# EAGLE design SensorNode (EAGLE 7.6.0)
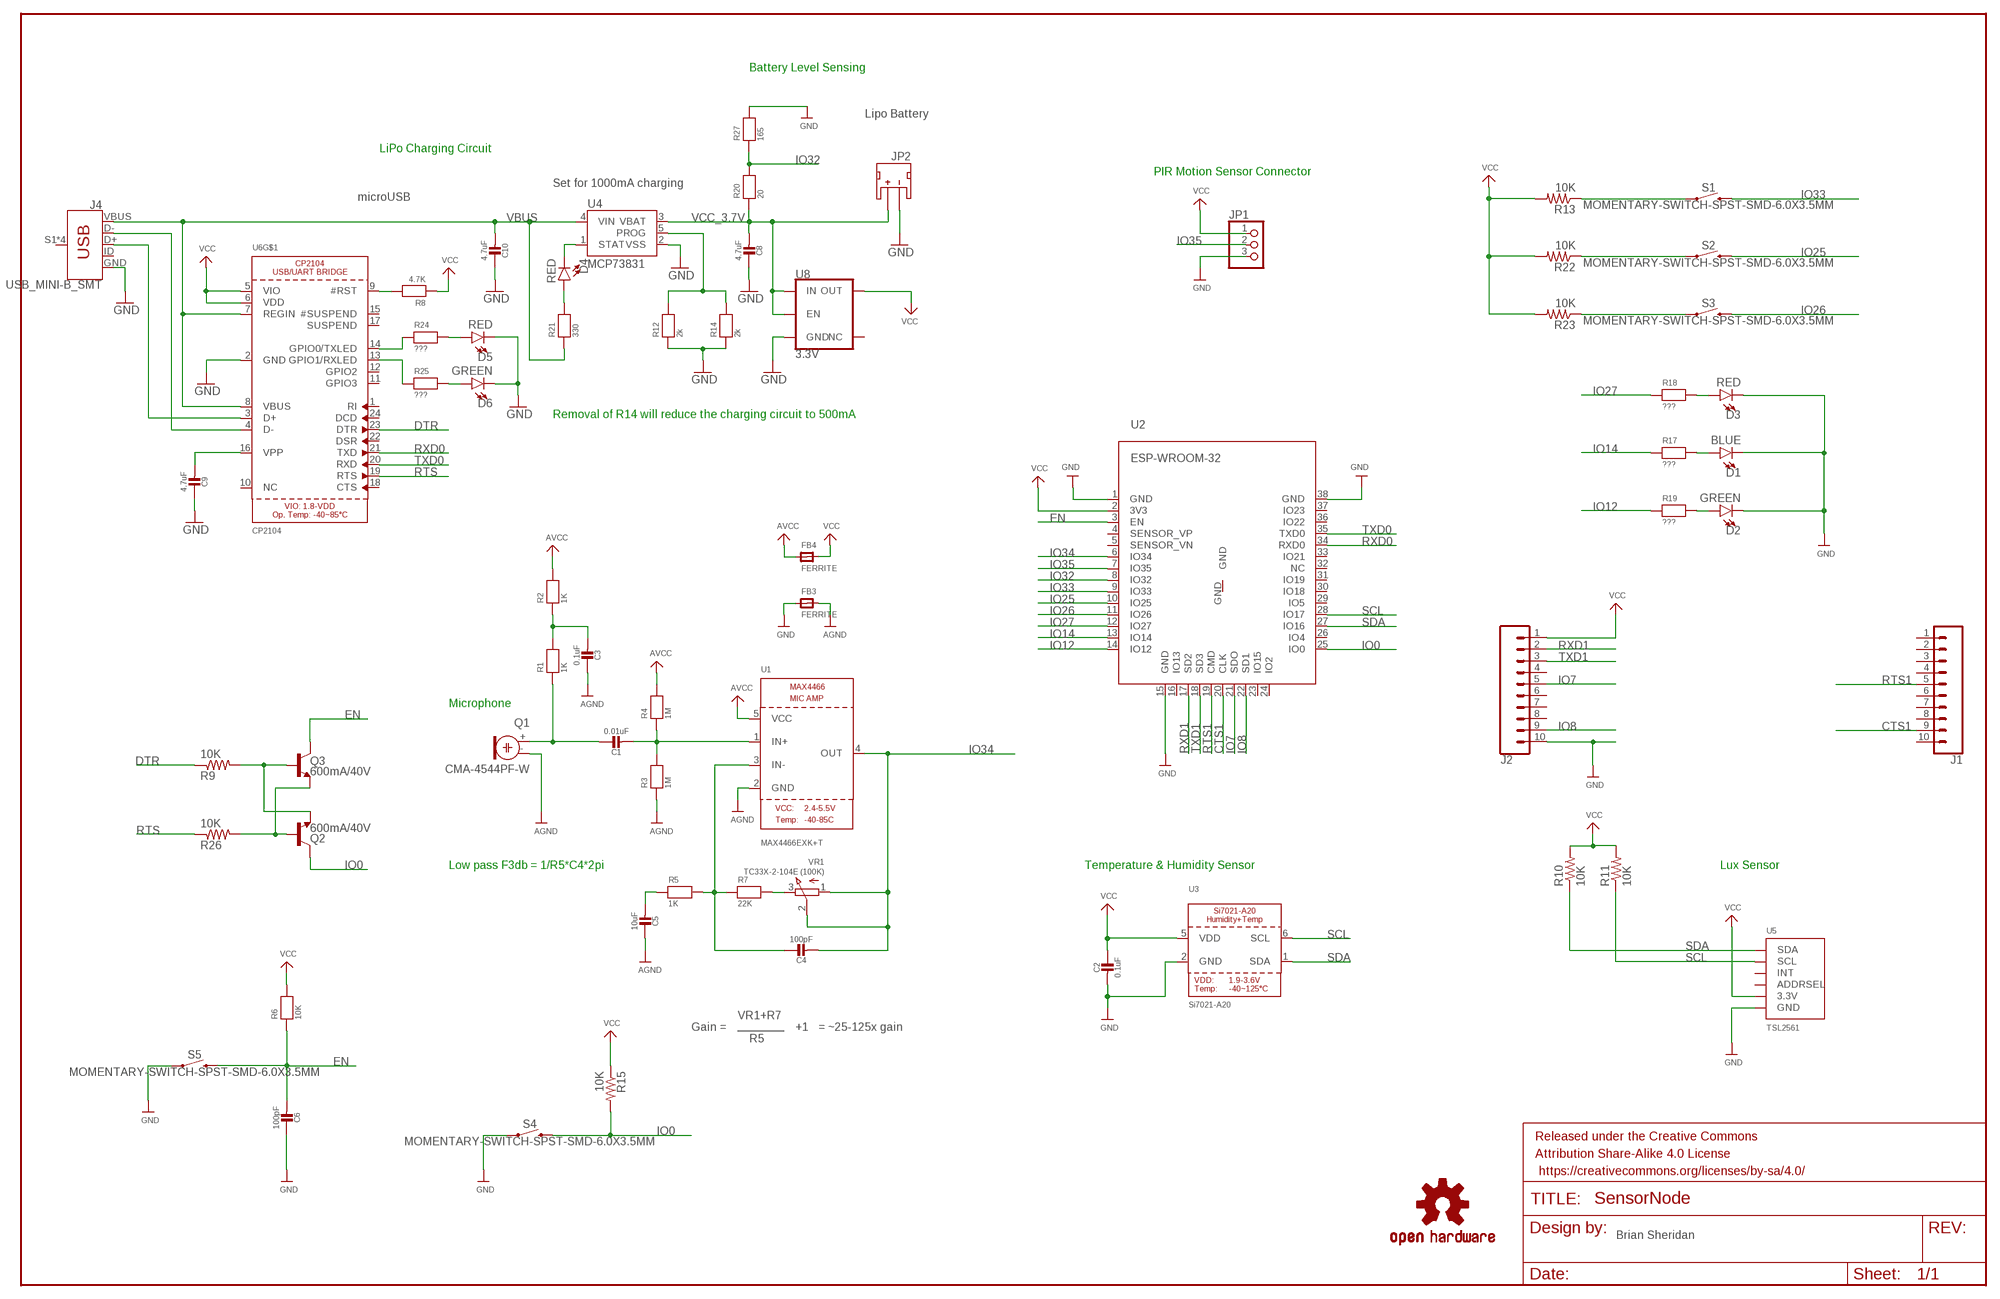
[diagram p0: schematic, sheet 1]

## Parts
C1  0.01uF  CAP_CERAMIC0805-NOOUTLINE  [0805-NO]
C2  0.1uF  CAP_CERAMIC0805-NOOUTLINE  [0805-NO]
C3  0.1uF  CAP_CERAMIC0805-NOOUTLINE  [0805-NO]
C4  100pF  CAP_CERAMIC0805-NOOUTLINE  [0805-NO]
C5  10uF  CAP_CERAMIC0805-NOOUTLINE  [0805-NO]
C6  100pF  CAP_CERAMIC0805-NOOUTLINE  [0805-NO]
C8  4.7uF  CAP_CERAMIC0805-NOOUTLINE  [0805-NO]
C9  4.7uF  CAP_CERAMIC0805-NOOUTLINE  [0805-NO]
C10  4.7uF  CAP_CERAMIC0805-NOOUTLINE  [0805-NO]
D1  BLUE  LED-BLUE1206  [LED-1206]
D2  GREEN  LED-GREEN1206  [LED-1206]
D3  RED  LED-RED1206  [LED-1206]
D4  RED  LED-RED1206  [LED-1206]
D5  RED  LED-RED1206  [LED-1206]
D6  GREEN  LED-GREEN1206  [LED-1206]
FB3  FERRITE  FERRITE0805  [0805]
FB4  FERRITE  FERRITE0805  [0805]
FRAME1  FRAME-LEDGER  [CREATIVE_COMMONS]
J1  CONN_102MMSMD  [1X10-2MM-SMD]
J2  CONN_102MMSMD  [1X10-2MM-SMD]
J4  USB_MINI-B_SMT  [USB-MINIB]
JP1  HEADER-1X376MIL  [1X03_ROUND_76]
JP2  JST  JST_2MM_MALE  [JST-2-SMD]
LOGO1  OSHW-LOGOM  [OSHW-LOGO-M]
Q1  CMA-4544PF-W  ELECTRET  [ELECTRET_9.7]
Q2  600mA/40V  TRANS_NPN-MMBT2222AL  [SOT23-3]
Q3  600mA/40V  TRANS_NPN-MMBT2222AL  [SOT23-3]
R1  1K  RESISTOR0805  [0805]
R2  1K  RESISTOR0805  [0805]
R3  1M  RESISTOR0805  [0805]
R4  1M  RESISTOR0805  [0805]
R5  1K  RESISTOR0805  [0805]
R6  10K  RESISTOR0805  [0805]
R7  22K  RESISTOR0805  [0805]
R8  4.7K  RESISTOR0805  [0805]
R9  10K  R-US_R0805  [R0805]
R10  10K  R-US_R0805  [R0805]
R11  10K  R-US_R0805  [R0805]
R12  2k  RESISTOR0805  [0805]
R13  10K  R-US_R0805  [R0805]
R14  2k  RESISTOR0805  [0805]
R15  10K  R-US_R0805  [R0805]
R17  ???  RESISTOR0805  [0805]
R18  ???  RESISTOR0805  [0805]
R19  ???  RESISTOR0805  [0805]
R20  20  RESISTOR0805  [0805]
R21  330  RESISTOR0805  [0805]
R22  10K  R-US_R0805  [R0805]
R23  10K  R-US_R0805  [R0805]
R24  ???  RESISTOR0805  [0805]
R25  ???  RESISTOR0805  [0805]
R26  10K  R-US_R0805  [R0805]
R27  165  RESISTOR0805  [0805]
S1  MOMENTARY-SWITCH-SPST-SMD-6.0X3.5MM  [TACTILE_SWITCH_SMD_6.0X3.5MM]
S2  MOMENTARY-SWITCH-SPST-SMD-6.0X3.5MM  [TACTILE_SWITCH_SMD_6.0X3.5MM]
S3  MOMENTARY-SWITCH-SPST-SMD-6.0X3.5MM  [TACTILE_SWITCH_SMD_6.0X3.5MM]
S4  MOMENTARY-SWITCH-SPST-SMD-6.0X3.5MM  [TACTILE_SWITCH_SMD_6.0X3.5MM]
S5  MOMENTARY-SWITCH-SPST-SMD-6.0X3.5MM  [TACTILE_SWITCH_SMD_6.0X3.5MM]
U1  MAX4466EXK+T  MAX4466""  [SC70-5]
U2  ESP-WROOM-32  [ESP-WROOM-32]
U3  Si7021-A20  SI7021-A20  [DFN6_3X3_SI]
U4  MCP73831  [SOT23-5]
U5  TSL2561  [TSL2561_FN]
U6  CP2104  [QFN24_4MM_SMSC]
U8  3.3V  V_REG_AP2112K-3.3V  [SOT23-5]
VR1  TC33X-2-104E (100K)  TRIMPOTTC33X-2  [TRIMPOT_BOURNS_TC33X-2]

## Nets
AGND: C3.1 C5.1 FB3.2 Q1.- R3.1 U1.2(GND)
AVCC: FB4.1 R2.2 R4.2 U1.5(VCC)
CTS1: J1.9 U2.20(CLK)
DTR: R9.1 U6.23(DTR)
EN: C6.2 Q3.3(C) R6.1 S5.2 U2.3(EN)
GND: C2.2 C6.1 C8.1 C9.1 C10.1 D1.C D2.C D3.C D5.C D6.C FB3.1 J2.10 J4.GND JP1.3 JP2.1(-) R12.1 R14.1 R27.2 S4.1 S5.1 U2.1(GND) U2.15(GND) U2.38(GND) U3.2(GND) U4.2(VSS) U5.VSS(GND) U6.2(GND) U8.2(GND)
IO0: Q2.3(C) R15.2 S4.2 U2.25(IO0)
IO7: J2.5 U2.21(SDO)
IO8: J2.9 U2.22(SD1)
IO12: R19.1 U2.14(IO12)
IO14: R17.1 U2.13(IO14)
IO25: S2.2 U2.10(IO25)
IO26: S3.2 U2.11(IO26)
IO27: R18.1 U2.12(IO27)
IO32: R20.2 R27.1 U2.8(IO32)
IO33: S1.2 U2.9(IO33)
IO34: C4.2 U1.4(OUT) U2.6(IO34) VR1.1(A) VR1.2(S)
IO35: JP1.2 U2.7(IO35)
N$3: C1.1 Q1.+ R1.1
N$5: C1.2 R3.2 R4.1 U1.1(IN+)
N$7: C4.1 R5.2 R7.1 U1.3(IN-)
N$8: C5.2 R5.1
N$9: R7.2 VR1.3(E)
N$10: C9.2 U6.16(VPP)
N$11: R8.2 U6.9(#RST)
N$13: Q2.2(E) Q3.1(B) R9.2
N$14: Q2.1(B) Q3.2(E) R26.2
N$23: D4.A R21.2
N$24: R13.1 S1.1
N$25: D3.A R18.2
N$26: D1.A R17.2
N$27: D2.A R19.2
N$28: R22.1 S2.1
N$29: R23.1 S3.1
N$32: C3.2 R1.2 R2.1
N$36: J4.D- U6.4(D-)
N$37: J4.D+ U6.3(D+)
N$41: D5.A R24.2
N$42: R24.1 U6.14(GPIO0/TXLED)
N$43: R25.1 U6.13(GPIO1/RXLED)
N$44: D6.A R25.2
PROG: R12.2 R14.2 U4.5(PROG)
RTS: R26.1 U6.19(RTS)
RTS1: J1.5 U2.19(CMD)
RXD0: U2.34(RXD0) U6.21(TXD)
RXD1: J2.2 U2.17(SD2)
SCL: R11.1 U2.28(IO17) U3.6(SCL) U5.CLK(SCL)
SDA: R10.1 U2.27(IO16) U3.1(SDA) U5.DATA(SDA)
STAT: D4.C U4.1(STAT)
TXD0: U2.35(TXD0) U6.20(RXD)
TXD1: J2.3 U2.18(SD3)
VBUS: C10.2 J4.VBUS R21.1 U4.4(VIN) U6.7(REGIN) U6.8(VBUS)
VCC: C2.1 FB4.2 J2.1 JP1.1 R6.2 R8.1 R10.2 R11.2 R13.2 R15.1 R22.2 R23.2 U2.2(3V3) U3.5(VDD) U5.VDD(3.3V) U6.5(VIO) U6.6(VDD) U8.5(OUT)
VCC_3.7V: C8.2 JP2.2(+) R20.1 U4.3(VBAT) U8.1(IN) U8.3(EN)
Unconnected: J1.1 J1.2 J1.3 J1.4 J1.6 J1.7 J1.8 J1.10 J2.4 J2.6 J2.7 J2.8 J4.ID J4.S1(SHIELD) J4.S2(SHIELD) J4.S3(SHIELD) J4.S4(SHIELD) JP2.NC1(PAD1) JP2.NC2(PAD2) U2.4(SENSOR_VP) U2.5(SENSOR_VN) U2.16(IO13) U2.23(IO15) U2.24(IO2) U2.26(IO4) U2.29(IO5) U2.30(IO18) U2.31(IO19) U2.32(NC) U2.33(IO21) U2.36(IO22) U2.37(IO23) U2.GND U5.ADR(ADDRSEL) U5.INT U6.1(RI) U6.10(NC) U6.11(GPIO3) U6.12(GPIO2) U6.15(#SUSPEND) U6.17(SUSPEND) U6.18(CTS) U6.22(DSR) U6.24(DCD) U8.4(NC)

## Notes on the sheet
- Battery Level Sensing
- Lipo Battery
- LiPo Charging Circuit
- PIR Motion Sensor Connector
- Set for 1000mA charging
- microUSB
- Removal of R14 will reduce the charging circuit to 500mA
- Microphone
- Low pass F3db = 1/R5*C4*2pi | Temperature & Humidity Sensor | Lux Sensor
- VR1+R7
- Gain = | +1 | = ~25-125x gain
- R5
- Brian Sheridan

## Power pins joined to a net without a drawn wire
TP: U6.THERM(TP)

## Library data of the parts
C1-C6 C8-C10 = microbuilder:CAP_CERAMIC: Ceramic Capacitors For new designs, use the packages preceded by an '_' character since they are more reliable: The following footprints should be used on most boards: _0402 - Standard footprint for regular board layouts _0603 - Standard footprint for regular board layouts _0805 - Standard footprint for regular board layouts _1206 - Standard footprint for regular board layouts For extremely tight-pitch boards where space is at a premium, the following 'micro-pitch' footprints can be used (smaller pads, no silkscreen outline, etc.): _0402MP - Micro-pitch footprint for very dense/compact boards _0603MP - Micro-pitch footprint for very dense/compact boards _0805MP - Micro-pitch footprint for very dense/compact boards _1206MP - Micro-pitch footprint for very dense/compact boards
D1 = SparkFun-LED:LED-BLUE: Blue SMD LED Used in manufacturing of various products at SparkFun Packages: 0603 - SMD 0603 package [Product Link] <http://www.digikey.com/product-detail/en/SMLE12BC7TT86/511-1589-2-ND/1641808> 1206 - SMD1206 package [Product Link] <http://www.digikey.com/product-detail/en/lite-on-inc/LTST-C150TBKT/160-1643-1-ND/573584> SparkFun Products: ESP8266 Thing-Dev Board <https://www.sparkfun.com/products/13711> RedBoard <https://www.sparkfun.com/products/12757>; PROD_ID: DIO-09911
D2 D6 = SparkFun-LED:LED-GREEN: Green SMD LED Used in manufacturing of various products at SparkFun Packages: 0603 - SMD 0603 package [Product Link] <http://www.futureelectronics.com/en/technologies/semiconductors/optoelectronics/leds/Pages/9894312-LTST-C190GKT.aspx?CrossPart=HSMG-C190&IM=0> LilyPad 1206 - SMD1206 LilyPad package [Product Link] <http://www.futureelectronics.com/en/Technologies/Product.aspx?ProductID=IN150NGHARVATEKCORPORATION2049943&IM=0> 1206 - SMD1206 package [Product Link] <http://www.futureelectronics.com/en/technologies/semiconductors/optoelectronics/leds/Pages/8315665-LTST-C150KGKT.aspx?IM=0> 1206 Bottom Mount -SMD 1206 Bottom Mount [Product Link] <http://www.digikey.com/product-detail/en/lite-on-inc/LTST-C230KGKT/160-1456-1-ND/386854> SparkFun Products: Pro Mini 328 -5V <https://www.sparkfun.com/products/821> RedBoard <https://www.sparkfun.com/products/12757> MP3 Trigger <https://www.sparkfun.com/products/13720> Makey Makey <https://www.sparkfun.com/products/11076>; PROD_ID: DIO-00862
D3-D5 = SparkFun-LED:LED-RED: Red SMD LED Used in manufacturing of most products at SparkFun Packages: 0603 - SMD 0603 package [Product Link] <http://docs.avagotech.com/docs/AV02-0551EN> 0603 SMART - SMD 0603 SMART package ( more efficient and expensive)[Product Link] <http://www.osram-os.com/Graphics/XPic2/00077099_0.pdf> 1206 - SMD1206 package [Product Link] <https://www.sparkfun.com/datasheets/DevTools/LilyPad/Q150OVS4.pdff> SparkFun Products: Pro Mini 328 -5V <https://www.sparkfun.com/products/821> RedBoard <https://www.sparkfun.com/products/12757> IOIO-OTG <https://www.sparkfun.com/products/13613>; PROD_ID: DIO-09912
FB3 FB4 = microbuilder:FERRITE: Ferrite Bead 0603 MMZ1608B121C - 120 Ohm @ 100MHz, 600mA, 0.15 Ohm DC Resistance - Digikey: 445-2164-1-ND BK1608HW121-T - 120 Ohm, 600mA Ferrite Chip - Digikey: 587-1876-2-ND 0805 HZ0805B272R-10 - 2.7K Ohm @ 100MHz, 200mA, 0.8 Ohm DC Resistance - Digikey: 240-2504-1-ND (see also Murata BLM21BD272SN1L) MMZ2012Y152B - 1.5K Ohm @ 100MHz, 500mA, 0.4 Ohm DC Resistance - Digikey: 445-1560-1-ND - Mainly for high frequency (80-400MHz) MMZ2012R102A - 1K Ohm @ 100MHz, 500mA, 0.3 Ohm DC Resistance - Digikey: 445-1555-2-ND - More general purpose (10-200MHz)
FRAME1 = SparkFun-Aesthetics:FRAME-LEDGER: Schematic Frame - Ledger Standard 11x14 US Ledger frame
J1 J2 = SparkFun-Connectors:CONN_10: Multi connection point. Often used as Generic Header-pin footprint for 0.1 inch spaced/style header connections On any of the 0.1 inch spaced packages, you can populate with these: Break Away Headers - Straight <https://www.sparkfun.com/products/116> (PRT-00116) Break Away Male Headers - Right Angle <https://www.sparkfun.com/products/553> (PRT-00553) Female Headers <https://www.sparkfun.com/products/115> (PRT-00115) Break Away Headers - Machine Pin <https://www.sparkfun.com/products/117> (PRT-00117) Break Away Female Headers - Swiss Machine Pin <https://www.sparkfun.com/products/743> (PRT-00743) Arduino Stackable Header - 10 Pin <https://www.sparkfun.com/products/11376> (PRT-11376) For SCREWTERMINALS and SPRING TERMINALS visit here: Screw Terimnals on SparkFun.com <https://www.sparkfun.com/search/results?term=Screw+Terminals> (5mm/3.5mm/2.54mm spacing) This device is also useful as a general connection point to wire up your design to another part of your project. Our various solder wires solder well into these plated through hole pads. Hook-Up Wire - Assortment (Stranded, 22 AWG) <https://www.sparkfun.com/products/11375> (PRT-11375) Hook-Up Wire - Assortment (Solid Core, 22 AWG) <https://www.sparkfun.com/products/11367> (PRT-11367) View the entire wire category on our website here <https://www.sparkfun.com/categories/141> Special notes: Molex polarized connector foot print use with SKU : PRT-08231 with associated crimp pins and housings. 1MM SMD Version SKU: PRT-10208 NOTES ON THE VARIANTS LOCK and LOCK_LONGPADS... This footprint was designed to help hold the alignment of a through-hole component (i.e. 6-pin header) while soldering it into place. You may notice that each hole has been shifted either up or down by 0.005 of an inch from it's more standard position (which is a perfectly straight line). This slight alteration caused the pins (the squares in the middle) to touch the edges of the holes. Because they are alternating, it causes a "brace" to hold the component in place. 0.005 has proven to be the perfect amount of "off-center" position when using our standard breakaway headers. Although looks a little odd when you look at the bare footprint, once you have a header in there, the alteration is very hard to notice. Also,if you push a header all the way into place, it is covered up entirely on the bottom side.; PROD_ID: CONN-09042; SF_ID: PRT-10030
J4 = SparkFun-Connectors:USB_MINI-B: USB type Mini-B Connector Breaks out 5th pin, and includes shield pins if needed. SparkFun Products: SparkFun FTDI Basic Breakout <https://www.sparkfun.com/products/9716> SparkFun XBee Explorer USB <https://www.sparkfun.com/products/11812> SparkFun Redboard <https://www.sparkfun.com/products/12757>; PROD_ID: CONN-08193; SF_ID: PRT-00587
JP1 = microbuilder:HEADER-1X3: PIN HEADER
JP2 = SparkFun-Connectors:JST_2MM_MALE: Mates to single-cell LiPo batteries. CONN-08352; PROD_ID: CONN-08352
LOGO1 = SparkFun-Aesthetics:OSHW-LOGO: Open-Source Hardware (OSHW) Logo This logo indicates the piece of hardware it is found on incorporates a OSHW license and/or adheres to the definition of open source hardware found here: http://freedomdefined.org/OSHW
Q1 = microbuilder:ELECTRET: Electret microphone Thru hole 2.54mm spacing with 9.7mm diameter
Q2 Q3 = SparkFun-DiscreteSemi:TRANS_NPN: NPN transistor Current controlled devices typically used to amplify current or used as a switch. BC547 - COM-08928 <http://www.sparkfun.com/products/8928> (TO-92 45V 100mA) (1.Collector 2.Base 3.Emitter) 2N3904 - COM-00521 <http://www.sparkfun.com/products/521> (TO-92 40V 200mA) (1.Emitter 2.Base 3.Collector) P2N2222A - COM-12852 <http://www.sparkfun.com/products/12852> (TO-92 40V 600mA) (1.Collector 2.Base 3.Emitter); PROD_ID: TRANS-08049
R1-R8 R12 R14 R17-R21 R24 R25 R27 = microbuilder:RESISTOR: Resistors 0402 - 0402 Surface Mount Package 22 Ohm 1% 1/16W [Digikey: 311-22.0LRTR-ND] 33 Ohm 5% 1/16W 1.0K 5% 1/16W 1.5K 5% 1/16W 2.0K 1% 1/16W 10.0K 1% 1/16W [Digikey: 311-10.0KLRTR-ND] 10.0K 5% 1/16W [Digikey: RMCF0402JT10K0TR-ND] 12.1K 1% 1/16W [Digikey: 311-22.0LRTR-ND] 100.0K 5% 1/16W 0603 - 0603 Surface Mount Package 0 Ohm 1/10 Watt 1% Resistor 15 Ohm 1/10 Watt 1% Resistor 33 Ohm 1/10 Watt 1% Resistor 49.9 Ohm 1/10 Watt 1% Resistor 100 Ohm 1/10 Watt 1% Resistor 150 Ohm 1/10 Watt 1% Resistor 240 Ohm 1/10 Watt 1% Resistor 390 Ohm 1/10 Watt 1% Resistor 560 Ohm 1/10 Watt 1% Resistor 680 Ohm 1/10 Watt 1% Resistor 750 Ohm 1/10 Watt 1% Resistor 1.0K Ohm 1/10 Watt 1% Resistor 1.5K Ohm 1/10 Watt 1% Resistor 2.0K Ohm 1/10 Watt 1% Resistor 2.2K Ohm 1/10 Watt 1% Resistor 3.3K Ohm 1/10 Watt 1% Resistor 4.7K Ohm 1/10 Watt 1% Resistor 10.0K Ohm 1/10 Watt 1% Resistor 12.0K Ohm 1/10 Watt 1% Resistor 12.1K Ohm 1/10 Watt 1% Resistor 20.0K Ohm 1/10 Watt 1% Resistor 33.0K Ohm 1/10 Watt 1% Resistor 100.0K Ohm 1/10 Watt 1% Resistor 0805 - 0805 Surface Mount Package 0 Ohm 1/8 Watt 1% Resistor 33 Ohm 1/8 Watt 1% Resistor 100 Ohm 1/8 Watt 1% Resistor 150 Ohm 1/8 Watt 1% Resistor 200 Ohm 1/8 Watt 1% Resistor 240 Ohm 1/8 Watt 1% Resistor 330 Ohm 1/8 Watt 1% Resistor 390 Ohm 1/8 Watt 1% Resistor 470 Ohm 1/8 Watt 1% Resistor 1.0K Ohm 1/8 Watt 1% Resistor 1.5K Ohm 1/8 Watt 1% Resistor 2.0K Ohm 1/8 Watt 1% Resistor 4.7K Ohm 1/8 Watt 1% Resistor 5.1K Ohm 1/8 Watt 1% Resistor 5.6K Ohm 1/8 Watt 1% Resistor 10.0K Ohm 1/8 Watt 1% Resistor 22.0K Ohm 1/8 Watt 1% Resistor 33.0K Ohm 1/8 Watt 1% Resistor 100K Ohm 1/8 Watt 1% Resistor 1206 - 1206 Surface Mount Package 2012 - 2010 Surface Mount Package 0.11 Ohm 1/2 Watt 1% Resistor - Digikey: RHM.11UCT-ND
R9-R11 R13 R15 R22 R23 R26 = adafruit:R-US_: RESISTOR, American symbol
S1-S5 = SparkFun-Switches:MOMENTARY-SWITCH-SPST: Momentary Switch (Pushbutton) - SPST Normally-open (NO) SPST momentary switches (buttons, pushbuttons). Variants PTH-12MM - 12mm square, through-hole Momentary Pushbutton Switch - 12mm Square <https://www.sparkfun.com/products/9190> (COM-09190) PTH-6.0MM, PTH-6.0MM-KIT - 6.0mm square, through-hole Mini Pushbutton Switch <https://www.sparkfun.com/products/97> (COM-00097) KIT package intended for soldering kit's - only one side of pads' copper is exposed. PTH-RIGHT-ANGLE-KIT - Right-angle, through-hole Right Angle Tactile Button <https://www.sparkfun.com/products/10791> - Used on SparkFun BigTime Watch Kit <https://www.sparkfun.com/products/11734> SMD-12MM - 12mm square, surface-mount Tactile Button - SMD (12mm) <https://www.sparkfun.com/products/12993> (COM-12993) Used on SparkFun PicoBoard <https://www.sparkfun.com/products/11888> SMD-4.5MM - 4.5mm Square Trackball Switch Used on SparkFun Blackberry Trackballer Breakout <https://www.sparkfun.com/products/13169> SMD-4.6MMX2.8MM - 4.60mm x 2.80mm, surface mount Used on SparkFun SAMD21 Mini Breakout <https://www.sparkfun.com/products/13664> SMD-5.2MM, SMD-5.2-REDUNDANT - 5.2mm square, surface-mount Mini Pushbutton Switch - SMD <https://www.sparkfun.com/products/8720> (COM-08720) Used on Arduino Pro Mini <https://www.sparkfun.com/products/11114> REDUNDANT package connects both switch circuits together SMD-6.0X3.5MM - 6.0 x 3.5mm, surface mount Momentary Reset Switch SMD <https://www.sparkfun.com/products/8229> (COM-08229) SMD-6.2MM-TALL - 6.2mm square, surface mount Tactile Button - SMD (6mm) <https://www.sparkfun.com/products/12992> Used on SparkFun Digital Sandbox <https://www.sparkfun.com/products/12651> SMD-RIGHT-ANGLE - Right-angle, surface mount Used on SparkFun Block for Intel® Edison - Arduino <https://www.sparkfun.com/products/13036>; PROD_ID: SWCH-00815; SF_SKU: COM-08229
U1 = microbuilder:MAX4466: MAX4466 - Microphone Pre-Amp
U2 = esp32:ESP-WROOM-32
U3 = microbuilder:SI7021-A20: Si7021-A20 - I2C Humidity and Temperature Sensor VDD: 1.9-3.6V Operating Temperature: -40~125°C +/-3% RH (max) 0..80% RH Humidity Sensor +/-0.4°C (max-, -10~85°C Temperature Sensor 150uA Active, 60nA Standby
U4 = SparkFun-PowerIC:MCP73831: Miniature single cell, fully integrated Li-Ion, Li-polymer charge management controller http://ww1.microchip.com/downloads/en/DeviceDoc/21984a.pdf IC-09995; PROD_ID: IC-09995
U5 = microbuilder:TSL2561: TSL2561 Light-To-Digital Sensor Mouser Part Numbers: CS (obsolete): 856-TSL2561CS DFN (cheapest): 856-TSL2561FN
U6 = microbuilder:CP2104: CP2104 - USB to UART Bridge VDD Output: 3.45V
U8 = SparkFun-IC-Power:V_REG_AP2112: AP2112 - 600mA CMOS LDO Regulator w/ Enable The AP2112 is CMOS process low dropout linear regulator with enable function, the regulator delivers a guaranteed 600mA (min.) continuous load current. Features Output Voltage Accuracy: ±1.5% Output Current: 600mA (Min.) Foldback Short Current Protection: 50mA Enable Function to Turn ON/OFF VOUT Low Dropout Voltage (3.3V): 250mV (Typ.) @IOUT=600mA Excellent Load Regulation: 0.2%/A (Typ.) Excellent Line Regulation: 0.02%/V (Typ.) Low Quiescent Current: 55μA (Typ.) Low Standby Current: 0.01μA (Typ.) Low Output Noise: 50μVRMS PSRR: 100Hz -65dB, 1kHz -65dB OTSD Protection Stable with 1.0μF Flexible Cap: Ceramic, Tantalum and Aluminum Electrolytic Operation Temperature Range: -40°C to 85°C ESD: MM 400V, HBM 4000V; PROD_ID: VREG-12457
VR1 = microbuilder:TRIMPOT: 3-Pin SMT Trimpots Bourns TC33 (X-2) Series 10K - Digikey: TC33X-2-103E 100K - Digikey: TC33X-104ECT-ND Bourns 3303 (W) Series 3mm 10K Single Turn - Digikey: 3303W-103ETR-ND 3mm 100K Single Turn - Digikey: 3303X-104ETR-ND

## Board
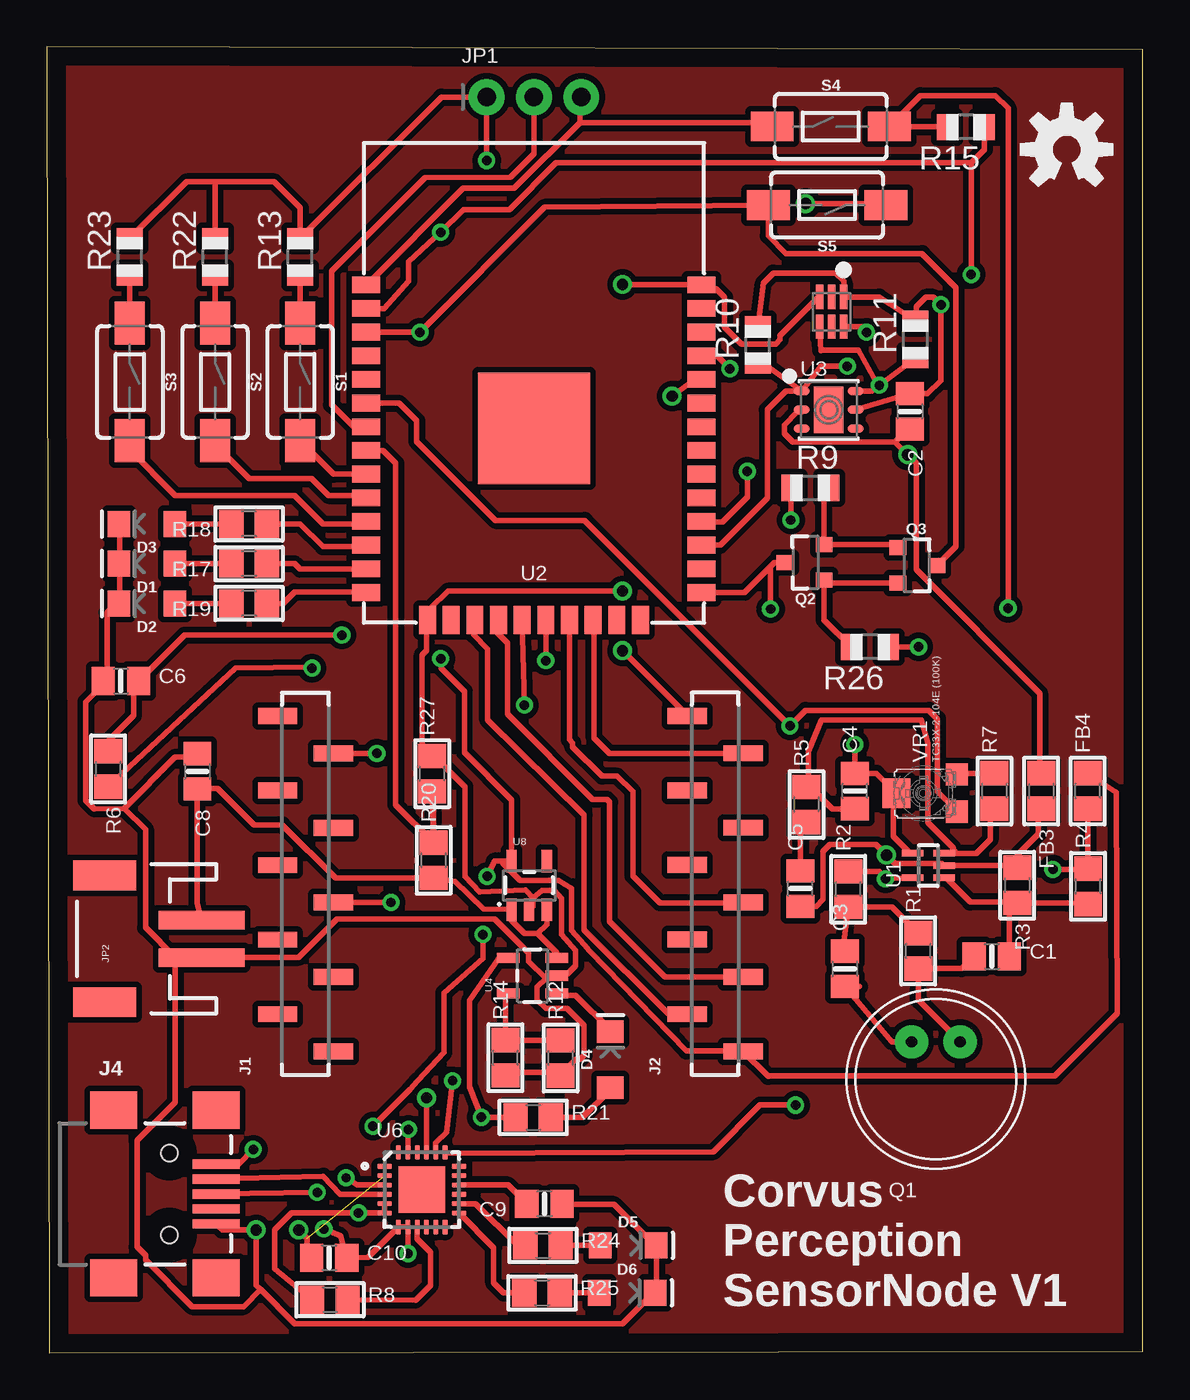
[diagram p1: board, top side]
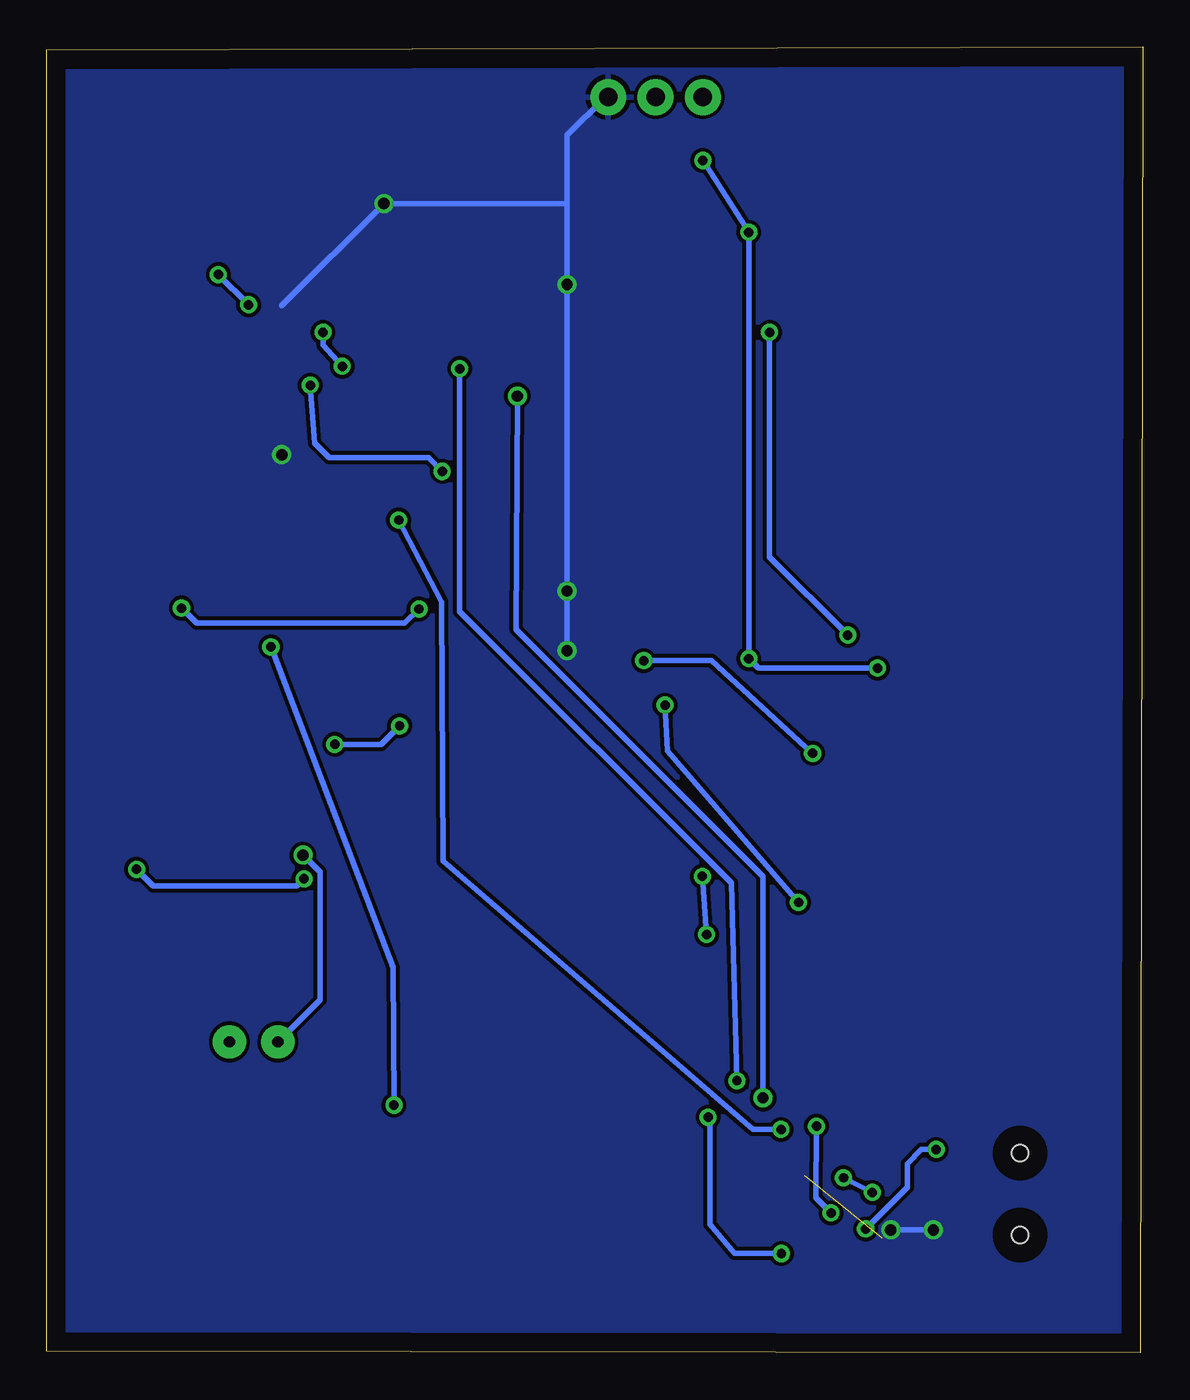
[diagram p2: board, bottom side, seen from below]

Size 58.85 x 70.12 mm. Coordinates in mm from the lower left corner, seen from the top.
Outline: 0.15,0 58.85,0.1 58.85,69.94 0,70.12 0.15,0
Copper layers (1*16): Top 0.035mm / dielectric 1.5mm / Bottom 0.035mm
Design rules "default *": minimum track width 12mil, minimum drill 0.5mm, track to track 8mil, track to pad 8mil, pad to pad 8mil, via to via 8mil, smd to smd 8mil, copper to edge 40mil, drill to drill 8mil, minimum pad ring 10mil, minimum via ring 8mil, stop-mask expansion 4mil, vias tented up to drill 0mil, thermal gap 10mil

### Footprints (pad centres in the part's own frame; a part is rotated, then mirrored left to right if it is on the bottom)
0805-NO = smd 1.24 x 1.5: 1 -0.95,0; 2 0.95,0
LED-1206 = smd 1.2 x 1.4: A -1.5,0; C 1.5,0
0805 = smd 1.3 x 1.5: 1 -0.95,0; 2 0.95,0
1X10-2MM-SMD = smd 0.85 x 2.1: 1 0,-1.5; 2 2,1.5; 3 4,-1.5; 4 6,1.5; 5 8,-1.5; 6 10,1.5; 7 12,-1.5; 8 14,1.5; 9 16,-1.5; 10 18,1.5
USB-MINIB = smd 2.5 x 0.5: D+ 2.5,0; D- 2.5,0.8; GND 2.5,-1.6; ID 2.5,-0.8; VBUS 2.5,1.6 | smd 2.5 x 2: S1 -3,4.5; S2 2.5,4.5; S3 -3,-4.5; S4 2.5,-4.5 | hole 0.9: 0,2.2; 0,-2.2
1X03_ROUND_76 = drill 1 pad 1.93: 1 -2.54,0; 2 0,0; 3 2.54,0
JST-2-SMD = smd 1 x 4.6: 1 -1,-3.7; 2 1,-3.7 | smd 1.6 x 3.4: NC1 -3.4,1.5; NC2 3.4,1.5
ELECTRET_9.7 = drill 0.6 pad 1.778: + 1.3,2; - -1.3,2
SOT23-3 = smd 0.8 x 0.9: 1 -0.95,-1; 2 0.95,-1; 3 0,1.1
R0805 = smd 1.1 x 1.4: 1 -1,0; 2 1,0
TACTILE_SWITCH_SMD_6.0X3.5MM = smd 2.3 x 1.6: 1 -3.15,0; 2 3.15,0
SC70-5 = smd 0.35 x 1.15: 1 -0.65,-0.85; 2 0,-0.85; 3 0.65,-0.85; 4 0.65,0.85; 5 -0.65,0.85
ESP-WROOM-32 = smd 0.9 x 1.5: 1 7.7,9; 2 6.43,9; 3 5.16,9; 4 3.89,9; 5 2.62,9; 6 1.35,9; 7 0.08,9; 8 -1.19,9; 9 -2.46,9; 10 -3.73,9; 11 -5,9; 12 -6.27,9; 13 -7.54,9; 14 -8.81,9; 25 -8.81,-9; 26 -7.54,-9; 27 -6.27,-9; 28 -5,-9; 29 -3.73,-9; 30 -2.46,-9; 31 -1.19,-9; 32 0.08,-9; 33 1.35,-9; 34 2.62,-9; 35 3.89,-9; 36 5.16,-9; 37 6.43,-9; 38 7.7,-9 | smd 1.5 x 0.9: 15 -10.3,5.715; 16 -10.3,4.445; 17 -10.3,3.175; 18 -10.3,1.905; 19 -10.3,0.635; 20 -10.3,-0.635; 21 -10.3,-1.905; 22 -10.3,-3.175; 23 -10.3,-4.445; 24 -10.3,-5.715 | smd 6 x 6: GND 0,0
DFN6_3X3_SI = smd 0.85 x 0.45: 1 -1.45,1; 2 -1.45,0; 3 -1.45,-1; 4 1.45,-1; 5 1.45,0; 6 1.45,1 | smd 1.6 x 2.5: P$1 0,0
SOT23-5 = smd 0.55 x 1.2: 1 -0.95,-1.3; 2 0,-1.3; 3 0.95,-1.3; 4 0.95,1.3; 5 -0.95,1.3
TSL2561_FN = smd 1.3 x 0.4: ADR -0.8,0; CLK 0.8,-0.65; DATA 0.8,0.65; INT 0.8,0; VDD -0.8,0.65; VSS -0.8,-0.65
QFN24_4MM_SMSC = smd 0.8 x 0.28: 1 -2,1.25; 2 -2,0.75; 3 -2,0.25; 4 -2,-0.25; 5 -2,-0.75; 6 -2,-1.25; 13 2,-1.25; 14 2,-0.75; 15 2,-0.25; 16 2,0.25; 17 2,0.75; 18 2,1.25 | smd 0.28 x 0.8: 7 -1.25,-2; 8 -0.75,-2; 9 -0.25,-2; 10 0.25,-2; 11 0.75,-2; 12 1.25,-2; 19 1.25,2; 20 0.75,2; 21 0.25,2; 22 -0.25,2; 23 -0.75,2; 24 -1.25,2 | smd 2.5 x 2.5: THERM 0,0
TRIMPOT_BOURNS_TC33X-2 = smd 1.2 x 1.2: 1 -1,-1.8; 3 1,-1.8 | smd 1.6 x 1.5: 2 0,1.45

### Placement (x,y rotation side)
C1  50.74,21.28 0 top
C2  46.34,50.53 270 top
C3  42.86,20.62 90 top
C4  43.39,30.16 90 top
C5  40.46,24.92 90 top
C6  3.99,36.07 0 top
C8  8.1,31.21 270 top
C9  26.73,8 180 top
C10  15.17,5.11 0 top
D1  5.38,42.37 180 top
D2  5.38,40.23 180 top
D3  5.38,44.5 180 top
D4  30.26,15.74 90 top
D5  31.22,5.77 0 top
D6  31.17,3.23 0 top
FB3  53.39,30.16 270 top
FB4  55.89,30.16 90 top
FRAME1  22.35,-12.6 0 top  (outside the outline)
J1  13.89,16.18 90 top
J2  35.89,16.19 90 top
J4  6.6,8.53 0 top
JP1  26.16,67.41 0 top
JP2  4.62,22.22 90 top
LOGO1  54.76,64.59 0 top
Q1  47.74,14.7 0 top
Q2  40.74,42.43 90 top
Q3  46.69,42.27 270 top
R1  46.79,21.58 90 top
R2  43.04,24.89 90 top
R3  52.1,25.1 270 top
R4  55.91,25.04 90 top
R5  40.79,29.43 90 top
R6  3.3,31.34 270 top
R7  50.89,30.16 90 top
R8  15.21,2.86 0 top
R9  41,46.43 0 top
R10  38.18,54.1 90 top
R11  46.63,54.41 90 top
R12  27.6,15.83 90 top
R13  13.61,58.83 90 top
R14  24.63,15.84 90 top
R15  49.34,65.8 180 top
R17  10.87,42.37 180 top
R18  10.87,44.5 180 top
R19  10.87,40.23 180 top
R20  20.78,26.44 90 top
R21  26.12,12.65 0 top
R22  9.04,58.83 90 top
R23  4.47,58.83 90 top
R24  26.64,5.77 0 top
R25  26.59,3.23 0 top
R26  44.19,37.9 180 top
R27  20.7,31.09 90 top
S1  13.61,52.12 270 top
S2  9.04,52.12 270 top
S3  4.47,52.12 270 top
S4  42.1,65.83 0 top
S5  41.89,61.61 180 top
U1  47.33,26.16 90 top
U2  26.16,49.63 90 top
U3  41.99,50.62 0 top
U4  26.08,20.25 90 top
U5  42.14,55.88 270 top
U6  20.14,8.76 0 top
U8  25.9,25.1 0 top
VR1  47.06,30.05 90 top

### Tracks (layer width: path | path; a pad name or v marks a point on that pad's centre or on a via)
AGND  (via drill 0.61)
  Top 0.305: FB3.2 53.1,29.12 53.24,28.99 53.24,27.86 52.1,26.73 R3.1 51.99,26.16 U1.2 48.06,26.26 45.54,26.26 v45.08,26.72 44.53,27.28 42.04,27.28 41.68,26.92 41.68,24.33 41.32,23.97 C5.1 | Q1.- 45.37,16.7 C3.1 43.64,19.67
  Bottom 0.305: v45.08,26.72 44.17,25.81 44.17,18.95 46.23,16.89 Q1.-
AVCC  (via drill 0.51)
  Top 0.305: FB4.1 55.49,29.11 55.9,28.69 R4.2 55.87,25.96 v54.03,25.96 | U1.5 46.47,25.53 v45.03,25.45 44.7,25.84 R2.2
  Bottom 0.305: v54.03,25.96 53.14,25.07 45.44,25.07 45.01,25.5 v45.03,25.45
CTS1  (via drill 0.51)
  Top 0.305: U2.20 v26.8,37.16 | v17.73,32.18 J1.9 | J1.9
  Bottom 0.305: v26.8,37.16 23.16,37.16 v17.73,32.18
DTR  (via drill 0.51)
  Top 0.305: U6.23 19.41,10.78 19.41,11.96 v19.43,11.99 | v39.95,44.7 39.95,46.39 R9.1
  Bottom 0.305: v19.43,11.99 20.93,11.99 37.57,26.42 37.64,40.31 v39.95,44.7
EN  (via drill 0.51)
  Top 0.305: U2.3 v20.04,54.79 26.74,61.49 S5.2 38.74,59.96 39.7,59 46.99,59 48.82,57.18 48.82,43.29 Q3.3 | R6.1 3.3,32.84 4.67,34.21 4.67,35.8 C6.2 7.4,38.53 v15.85,38.53
  Bottom 0.305: v15.85,38.53 20.04,42.72 v20.04,54.79
GND  (via drill 0.61)  (1 unrouted)
  Top 0.305: 26.11,24.43 26.11,23.98 U8.2 | 26.11,24.43 26.59,24.82 27.25,24.82 27.64,24.38 27.64,22.45 28.4,21.62 28.4,20.78 27.94,20.32 27.48,20.32 U4.2 27.25,20.09 26.8,20.09 | 26.8,20.09 26.34,19.63 26.34,18.95 26.8,18.49 27.94,18.49 28.85,17.58 28.85,15.98 28.63,15.75 28.4,15.75 27.71,15.06 R12.1 27.48,15.06 24.74,15.06 R14.1 | 26.11,24.43 25.7,24.84 23.24,24.74 22.45,25.58 22.45,30.38 20.85,31.98 R27.2 20.62,32.21 20.17,32.66 20.17,37.46 20.4,37.69 20.4,39.29 U2.15 20.62,39.52 20.62,39.98 21.54,40.89 v30.91,40.89 | v13.54,6.6 14,6.15 14,5.23 C10.1 | J4.GND 9.19,6.83 9.42,6.6 v11.25,6.6 11.25,3.63 11.48,3.4 | C9.1 27.71,7.98 30.45,7.98 32.51,5.92 D5.C 32.74,5.69 32.74,3.4 D6.C 32.51,3.17 30.91,1.57 13.31,1.57 11.48,3.4 | D3.C 3.94,44.32 3.94,42.49 D1.C 3.94,42.27 3.94,40.44 D2.C 3.71,40.21 3.25,39.75 3.25,36.09 C6.1 3.02,35.86 2.11,34.95 2.11,29.67 2.57,29.21 4.17,29.24 | 4.17,29.24 6.91,31.98 8.05,31.98 C8.1 | 6.91,21.23 8.28,21.23 JP2.1 | 6.91,21.23 5.31,22.83 5.31,28.09 4.17,29.24 | 11.48,3.4 10.57,2.49 7.82,2.49 5.31,5 5.31,5.23 4.85,5.69 4.85,11.4 6.91,13.46 6.91,21.23 | 6.91,21.23 JP2.1 | 26.8,20.09 25.88,21.01 25.88,21.46 24.05,23.29 15.6,23.29 13.54,21.23 8.51,21.23 JP2.1 | 45.54,48.89 40.06,48.89 39.6,49.35 39.6,49.81 40.28,50.5 40.51,50.5 U3.2 | 45.54,48.89 46.23,49.58 C2.2 | 45.54,48.89 v46.23,48.21 46.69,47.75 46.69,42.04 53.31,35.41 53.31,31.29 FB3.1 | U5.VSS 41.43,56.67 39.37,54.61 39.37,54.38 39.14,54.15 37.31,54.15 36.4,55.07 36.4,56.67 35.94,57.12 35.26,57.12 U2.38 35.03,57.35 v30.91,57.35 | 28.63,66.04 25.1,62.51 22.35,62.51 17.2,57.35 U2.1
  Top 0.305: 28.63,66.04 28.63,67.41 JP1.3 | v30.91,37.69 34.34,34.26 J2.10 | 28.63,66.04 38.91,66.04 S4.1 | v40.74,61.7 44.86,61.7 S5.1
  Bottom 0.305: v11.25,6.6 v13.54,6.6 | 30.91,61.7 30.91,65.35 28.85,67.41 JP1.3 | 30.91,61.7 v30.91,57.35 v30.91,40.89 v30.91,37.69 | 30.91,61.7 v40.74,61.7 46.23,56.21
  pour Bottom (isolate 0.203): 1.14,68.96 57.71,68.81 58.73,0.22 1.19,0.22
IO0  (via drill 0.51)
  Top 0.305: Q2.3 39.08,42.43 38.86,42.21 | 38.86,42.21 37.46,40.82 U2.25 | R15.2 48.32,65.83 S4.2 46.91,67.49 50.93,67.49 51.61,66.8 v51.61,39.98 | v38.86,39.93 38.86,42.21
  Bottom 0.305: v51.61,39.98 50.8,39.17 39.62,39.17 v38.86,39.93
IO7
  Top 0.305: J2.5 37.36,24.16 32.92,24.16 31.47,25.6 31.47,30.12 30.63,30.96 29.82,30.96 28.24,32.54 28.24,32.74 28.07,32.92 U2.21
IO8
  Top 0.305: J2.9 30.22,32.19 29.39,33.02 29.39,39.28 U2.22
IO12
  Top 0.305: R19.1 12.7,40.23 13.31,40.84 17.14,40.84 U2.14
IO14
  Top 0.305: R17.1 13.31,42.37 13.61,42.06 17.13,42.06 U2.13
IO25
  Top 0.305: S2.2 9.02,48.79 10.87,46.94 14.22,46.94 15.14,46.02 17.04,46.02 U2.10
IO26
  Top 0.305: S3.2 4.43,48.5 6.91,46.02 13.31,46.02 14.83,44.5 17.03,44.5 U2.11
IO27
  Top 0.305: R18.1 13.61,44.5 14.83,43.28 17.08,43.28 U2.12
IO32
  Top 0.305: R27.1 R20.2 | U2.8 18.06,48.44 18.75,47.75 18.75,29.42 R20.2 | R20.2 20.78,29.82 20.7,29.9
IO33
  Top 0.305: U2.9 15.41,47.17 S1.2
IO34  (via drill 0.51)
  Top 0.305: U1.4 46.36,26.81 45.47,27.71 45.47,29.9 VR1.2 44.55,31.11 C4.2 v43.39,32.67 | U2.6 18.92,50.98 19.86,50.04 19.86,48.92 24.1,44.68 28.88,44.68 v39.9,33.65 40.74,34.49 47.37,34.49 47.83,34.04 47.83,30.15 48.74,29.24 VR1.1
  Bottom 0.305: v39.9,33.65 40.89,32.67 v43.39,32.67
IO35
  Top 0.305: JP1.2 26.16,64.36 24.89,63.12 20.32,63.09 15.29,58.06 15.29,50.9 16.66,49.53 16.98,49.53 U2.7
N$3
  Top 0.305: Q1.+ 46.79,18.94 R1.1 49.13,20.63 C1.1
N$5
  Top 0.305: R4.1 54.78,24.15 R3.2 | R3.2 51.69,23.73 C1.2 | R3.2 52.05,24.21 49.58,24.21 48.27,25.51 U1.1
N$7
  Top 0.305: R5.2 40.89,30.49 | 40.89,30.49 40.89,32.28 41.58,33.96 46.96,33.96 47.29,32.74 47.29,28.47 48.67,27.1 48.67,26.95 | 48.38,26.81 U1.3 | 48.67,26.95 48.67,26.8 | R7.1 50.65,28.97 50.65,27.56 49.9,26.81 U1.3 | 40.89,30.49 42.17,29.21 C4.1 | U1.3 48.74,26.95 48.67,26.95
N$8
  Top 0.305: R5.1 40.46,28.15 C5.2
N$9
  Top 0.305: VR1.3 48.93,31.11 R7.2
N$10
  Top 0.305: C9.2 24.77,9.01 U6.16
N$11
  Top 0.305: R8.2 19.8,2.83 20.6,3.63 20.6,5.41 19.89,6.12 U6.9
N$13
  Top 0.305: Q3.1 45.53,43.38 Q2.2 41.74,46.17 R9.2
N$14
  Top 0.305: R26.2 41.74,39.35 Q2.1 41.91,41.32 Q3.2
N$17
  pour Top (isolate 0.305): 0.18,69.93 0.3,-0.36 58.12,0 58.12,69.8
N$23
  Top 0.305: D4.A 30.26,14.13 28.78,12.65 R21.2
N$24
  Top 0.305: R13.1 S1.1
N$25
  Top 0.305: R18.2 D3.A
N$26
  Top 0.305: D1.A R17.2
N$27
  Top 0.305: D2.A R19.2
N$28
  Top 0.305: R22.1 S2.1
N$29
  Top 0.305: R23.1 S3.1
N$32
  Top 0.305: R1.2 45.38,23.94 R2.1 | R2.1 42.51,23.71 | C3.2 42.73,21.69 R2.1
N$36
  Top 0.305: J4.D- 14.85,9.49 15.75,8.51 U6.4
N$37  (via drill 0.51)
  Top 0.305: J4.D+ v14.53,8.61 | U6.3 16.66,9.02 v16.08,9.4
  Bottom 0.305: v14.53,8.61 v16.08,9.4
N$41
  Top 0.305: D5.A R24.2
N$42
  Top 0.305: R24.1 25.27,5.77 23.04,8 22.15,8 U6.14
N$43
  Top 0.305: R25.1 24.54,3.23 24,3.76 24,5.65 U6.13
N$44
  Top 0.305: D6.A R25.2
PROG
  Top 0.305: R12.2 24.65,16.78 R14.2 24.63,19.15 U4.5
RTS  (via drill 0.51)
  Top 0.305: R26.1 v46.81,37.9 | U6.19 21.44,10.72 35.79,10.79 38.3,13.3 v40.2,13.3
  Bottom 0.305: v40.2,13.3 40.26,20.7 v46.81,37.9
RTS1  (via drill 0.51)
  Top 0.305: U2.19 v25.65,34.77 | 18.54,24.18 v18.49,24.18 J1.5
  Bottom 0.305: v25.65,34.77 25.53,32.31 v18.49,24.18
RXD0  (via drill 0.61)
  Top 0.305: 20.37,10.78 U6.21 20.4,10.95 v20.4,13.69 | v33.58,51.36 34.57,52.1 35.03,52.1 U2.34
  Bottom 0.305: v20.4,13.69 20.4,25.58 33.65,38.84 v33.58,51.36
RXD1
  Top 0.305: J2.2 33.37,18.19 28.85,22.71 28.85,28.88 23.67,33.99 23.67,37.8 22.91,38.56 22.91,39.26 U2.17
SCL  (via drill 0.51)
  Top 0.305: 44.66,51.88 R11.1 | 44.66,51.88 43.59,53.82 41.55,53.82 41.56,53.81 U5.CLK | U3.6 44.31,51.62 v44.7,51.94 44.63,51.64 44.66,51.88 | v37.62,47.32 37.62,45.95 36.27,44.6 35.19,44.6 U2.28
  Bottom 0.305: v44.7,51.94 44.48,48.84 43.69,48.06 38.35,48.06 v37.62,47.32
SDA  (via drill 0.51)
  Top 0.305: R10.1 38.64,52.99 U3.1 | U5.DATA 43.73,55.08 v44.02,54.79 | v42.98,52.96 41.57,52.96 U3.1 | U3.1 39.68,51.62 38.68,50.62 38.68,45.87 36.17,43.36 U2.27
  Bottom 0.305: v44.02,54.79 44.02,54.1 v42.98,52.96
STAT
  Top 0.305: D4.C 30.26,17.34 28.4,19.2 27.48,19.2 U4.1
TXD0  (via drill 0.51)
  Top 0.305: U6.20 20.89,11.27 21.46,11.84 v21.79,14.6 | v36.68,52.83 35.99,53.52 U2.35
  Bottom 0.305: v21.79,14.6 22.1,25.22 36.68,39.8 v36.68,52.83
TXD1
  Top 0.305: J2.3 33.2,20.19 30.23,23.16 30.23,29.57 30.07,29.72 29.31,29.72 24.74,34.29 24.74,38.1 24.13,38.71 24.13,39.2 U2.18
VBUS  (via drill 0.51)
  Top 0.305: U4.4 24.3,21.2 22.71,18.92 22.71,14.27 v23.34,12.65 R21.1 | v14.88,6.65 15.77,6.27 16.08,5.15 C10.2 17.26,5.13 U6.7 U6.8 19.39,5.35 v19.41,5.33 | J4.VBUS 10.31,10.13 v11.1,10.92
  Bottom 0.305: v19.41,5.33 21.92,5.33 23.24,6.91 23.24,12.55 v23.34,12.65 | v11.1,10.92 11.89,10.92 12.65,10.16 12.65,8.89 v14.88,6.65
VCC  (via drill 0.51)
  Top 0.305: 18.11,7.54 U6.6 | U6.5 U6.6 | U3.5 C2.1 47.29,51.48 48.01,52.2 v48.01,56.26 47.6,56.67 47.19,56.67 46.69,56.16 46.69,55.46 R11.2 44.7,56.68 U5.VDD 42.79,57.52 42.34,57.96 39.01,57.96 38.48,57.43 R10.2 | 9.09,62.86 12.22,62.86 13.61,61.47 R13.2 21.2,67.41 JP1.1 v23.62,64.01 | 9.09,62.86 7.51,62.86 R23.2 | R22.2 9.04,62.81 9.09,62.86 | FB4.2 57.43,30.07 57.48,18.21 54.13,14.86 38.74,14.86 38.74,14.83 J2.1 37.31,16.21 34.34,16.21 29.13,21.59 28.85,21.92 28.17,22.68 28.17,24.94 27.48,25.35 25.43,25.35 24.51,26.26 24.51,26.4 | R6.2 10.14,36.75 14.17,36.83 v14.25,36.75 | R8.1 12.24,4.52 12.24,6.6 13.15,7.51 v16.74,7.51 U6.6 | 24.51,26.4 U8.5 24.97,26.41 24.97,29.69 22.43,32.23 22.43,35.51 21.18,36.75 21.18,37.24 v21.16,37.26 | 24.51,26.4 24.04,26.4 v23.65,25.58 | U2.2 18.12,56.06 19.43,57.53 19.43,58.58 v21.16,60.15 22.38,61.37 24.84,61.37 27.36,63.88 49.63,63.88 | R15.1 50.34,64.59 49.63,63.88 | 49.63,63.88 v49.63,57.89 | v23.42,22.45 23.42,21.18 21.34,19.33 21.34,16.13 19.91,14.6 19.51,14.15 v17.53,12.17
  Bottom 0.305: v23.65,25.58 v23.42,22.45 | v17.53,12.17 17.55,8.33 v16.74,7.51 | v23.62,64.01 v21.16,60.15 v21.16,37.26 20.65,36.75 v14.25,36.75 | v49.63,57.89 v48.01,56.26
VCC_3.7V
  Top 0.305: JP2.2 8.1,24.14 C8.2 | C8.2 7.96,30.39 | C8.2 8.14,30.3 9.19,30.3 11.15,28.35 12.65,28.35 15.5,25.49 R20.1 21.93,25.3 23.45,23.82 U8.1 24.95,23.2 25.65,22.5 26.37,22.5 | 26.37,22.5 26.85,22.99 U8.3 | 26.37,22.5 27.38,21.49 U4.3

### Text on the board
tSilk: Corvus / Perception / SensorNode V1